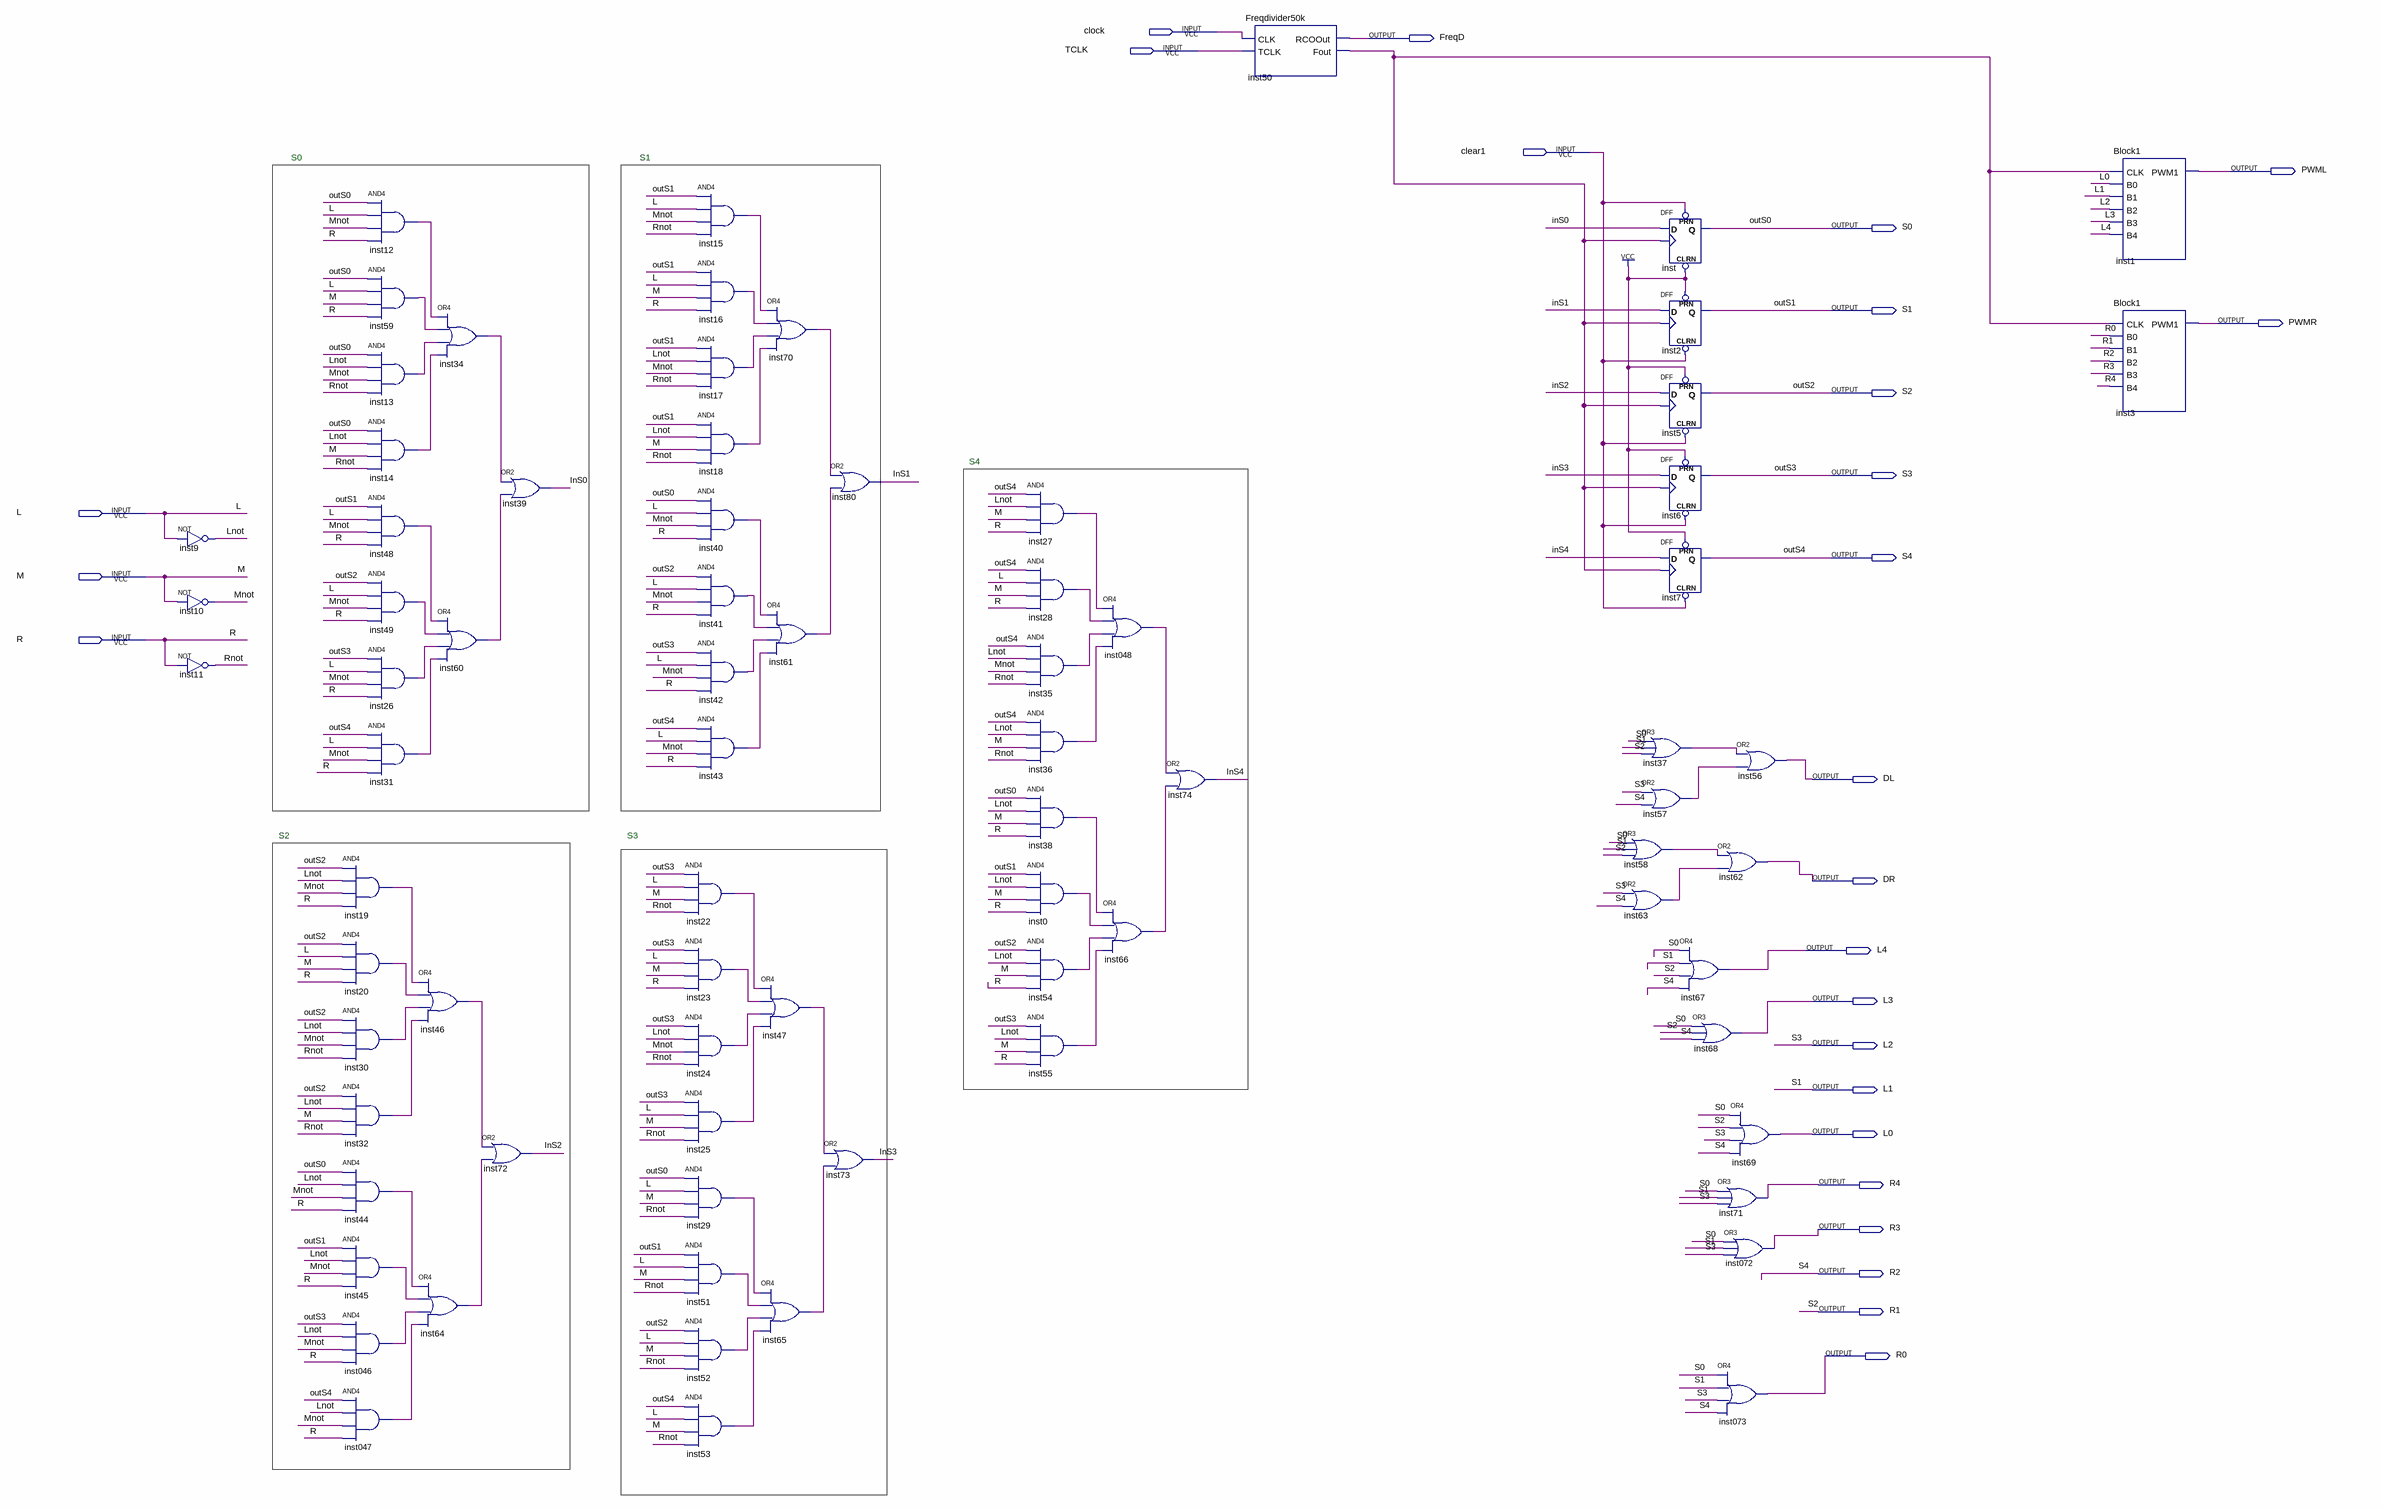
[diagram p0: schematic sheet]
// Quartus schematic project.bdf as structural Verilog: 78 symbols, 26 pins
module project (
  input  clock,
  input  TCLK,
  input  clear1,
  input  L,
  input  M,
  input  R,
  output FreqD,
  output PWML,
  output S0,
  output S1,
  output PWMR,
  output S2,
  output S3,
  output S4,
  output DL,
  output DR,
  output L4,
  output L3,
  output L2,
  output L1,
  output L0,
  output R4,
  output R3,
  output R2,
  output R1,
  output R0
);

  wire InS0, InS1, InS2, InS3, InS4, inst0_out, inst12_out, inst13_out, inst14_out, inst15_out, inst16_out,
       inst17_out, inst18_out, inst19_out, inst20_out, inst22_out, inst23_out, inst24_out, inst25_out,
       inst26_out, inst27_out, inst28_out, inst29_out, inst30_out, inst31_out, inst32_out, inst34_out,
       inst35_out, inst36_out, inst37_out, inst38_out, inst40_out, inst41_out, inst42_out, inst43_out,
       inst44_out, inst45_out, inst046_out, inst46_out, inst047_out, inst47_out, inst48_out, inst048_out,
       inst49_out, inst50_fout, inst51_out, inst52_out, inst53_out, inst54_out, inst55_out, inst57_out,
       inst58_out, inst59_out, inst60_out, inst61_out, inst63_out, inst64_out, inst65_out, inst66_out,
       inst70_out, Lnot, Mnot, Rnot;

  not inst9 (Lnot, L);
  not inst10 (Mnot, M);
  not inst11 (Rnot, R);
  and inst12 (inst12_out, S0, L, Mnot, R);
  and inst59 (inst59_out, S0, L, M, R);
  and inst13 (inst13_out, S0, Lnot, Mnot, Rnot);
  and inst14 (inst14_out, S0, Lnot, M, Rnot);
  and inst48 (inst48_out, L1, L, Mnot, R);
  and inst49 (inst49_out, R1, L, Mnot, R);
  and inst26 (inst26_out, L2, L, Mnot, R);
  and inst31 (inst31_out, R2, L, Mnot, R);
  and inst19 (inst19_out, R1, Lnot, Mnot, R);
  and inst20 (inst20_out, R1, L, M, R);
  and inst30 (inst30_out, R1, Lnot, Mnot, Rnot);
  and inst32 (inst32_out, R1, Lnot, M, Rnot);
  and inst44 (inst44_out, S0, Lnot, Mnot, R);
  and inst45 (inst45_out, L1, Lnot, Mnot, R);
  and inst046 (inst046_out, L2, Lnot, Mnot, R);
  and inst047 (inst047_out, R2, Lnot, Mnot, R);
  or inst34 (inst34_out, inst12_out, inst59_out, inst13_out, inst14_out);
  or inst60 (inst60_out, inst48_out, inst49_out, inst26_out, inst31_out);
  or inst46 (inst46_out, inst19_out, inst20_out, inst30_out, inst32_out);
  or inst64 (inst64_out, inst44_out, inst45_out, inst046_out, inst047_out);
  or inst72 (InS2, inst46_out, inst64_out);
  or inst39 (InS0, inst34_out, inst60_out);
  and inst22 (inst22_out, L2, L, M, Rnot);
  and inst23 (inst23_out, L2, L, M, R);
  and inst24 (inst24_out, L2, Lnot, Mnot, Rnot);
  and inst25 (inst25_out, L2, L, M, Rnot);
  and inst29 (inst29_out, S0, L, M, Rnot);
  and inst51 (inst51_out, L1, L, M, Rnot);
  and inst52 (inst52_out, R1, L, M, Rnot);
  and inst53 (inst53_out, R2, L, M, Rnot);
  and inst15 (inst15_out, L1, L, Mnot, Rnot);
  and inst16 (inst16_out, L1, L, M, R);
  and inst17 (inst17_out, L1, Lnot, Mnot, Rnot);
  and inst18 (inst18_out, L1, Lnot, M, Rnot);
  and inst40 (inst40_out, S0, L, Mnot, R);
  and inst41 (inst41_out, R1, L, Mnot, R);
  and inst42 (inst42_out, L2, L, Mnot, R);
  and inst43 (inst43_out, R2, L, Mnot, R);
  or inst70 (inst70_out, inst15_out, inst16_out, inst17_out, inst18_out);
  or inst61 (inst61_out, inst40_out, inst41_out, inst42_out, inst43_out);
  or inst47 (inst47_out, inst22_out, inst23_out, inst24_out, inst25_out);
  or inst65 (inst65_out, inst29_out, inst51_out, inst52_out, inst53_out);
  or inst80 (InS1, inst70_out, inst61_out);
  or inst73 (InS3, inst47_out, inst65_out);
  and inst27 (inst27_out, R2, Lnot, M, R);
  and inst28 (inst28_out, R2, L, M, R);
  and inst35 (inst35_out, R2, Lnot, Mnot, Rnot);
  and inst36 (inst36_out, R2, Lnot, M, Rnot);
  and inst38 (inst38_out, S0, Lnot, M, R);
  and inst0 (inst0_out, L1, Lnot, M, R);
  and inst54 (inst54_out, R1, Lnot, M, R);
  and inst55 (inst55_out, L2, Lnot, M, R);
  or inst048 (inst048_out, inst27_out, inst28_out, inst35_out, inst36_out);
  or inst66 (inst66_out, inst38_out, inst0_out, inst54_out, inst55_out);
  or inst74 (InS4, inst048_out, inst66_out);
  Freqdivider50k inst50 (.CLK(clock), .TCLK(TCLK), .RCOOut(FreqD), .Fout(inst50_fout));
  or inst37 (inst37_out, S0, L1, R1);
  or inst57 (inst57_out, L2, R2);
  or inst58 (inst58_out, S0, L1, R1);
  or inst63 (inst63_out, L2, R2);
  DFF inst (.CLRN(1'b1), .CLK(inst50_fout), .D(InS0), .PRN(clear1), .Q(S0));
  DFF inst2 (.CLRN(clear1), .CLK(inst50_fout), .D(InS1), .PRN(1'b1), .Q(L1));
  DFF inst5 (.CLRN(clear1), .CLK(inst50_fout), .D(InS2), .PRN(1'b1), .Q(R1));
  DFF inst6 (.CLRN(clear1), .CLK(inst50_fout), .D(InS3), .PRN(1'b1), .Q(L2));
  DFF inst7 (.CLRN(clear1), .CLK(inst50_fout), .D(InS4), .PRN(1'b1), .Q(R2));
  or inst67 (L4, S0, L1, R1, R2);
  or inst68 (L3, S0, R1, R2);
  or inst56 (DL, inst37_out, inst57_out);
  or inst62 (DR, inst58_out, inst63_out);
  or inst69 (L0, S0, R1, L2, R2);
  or inst71 (R4, S0, L1, L2);
  or inst072 (R3, S0, L1, L2);
  or inst073 (R0, S0, L1, L2, R2);
  Block1 inst1 (.CLK(inst50_fout), .B0(L0), .B1(L1), .B2(L2), .B3(L3), .B4(L4), .PWM1(PWML));
  Block1 inst3 (.CLK(inst50_fout), .B0(R0), .B1(R1), .B2(R2), .B3(R3), .B4(R4), .PWM1(PWMR));

  assign S1 = L1;
  assign S2 = R1;
  assign S3 = L2;
  assign S4 = R2;

  // Other names for the same wires on the sheet: outS0 = S0; outS1 = L1; outS2 = R1; outS3 = L2; outS4 = R2

  // Notes on the sheet:
  //   S0
  //   S1
  //   S4
  //   S2
  //   S3
endmodule
